# Altium schematic sheet mcu2.SchDoc
size A4
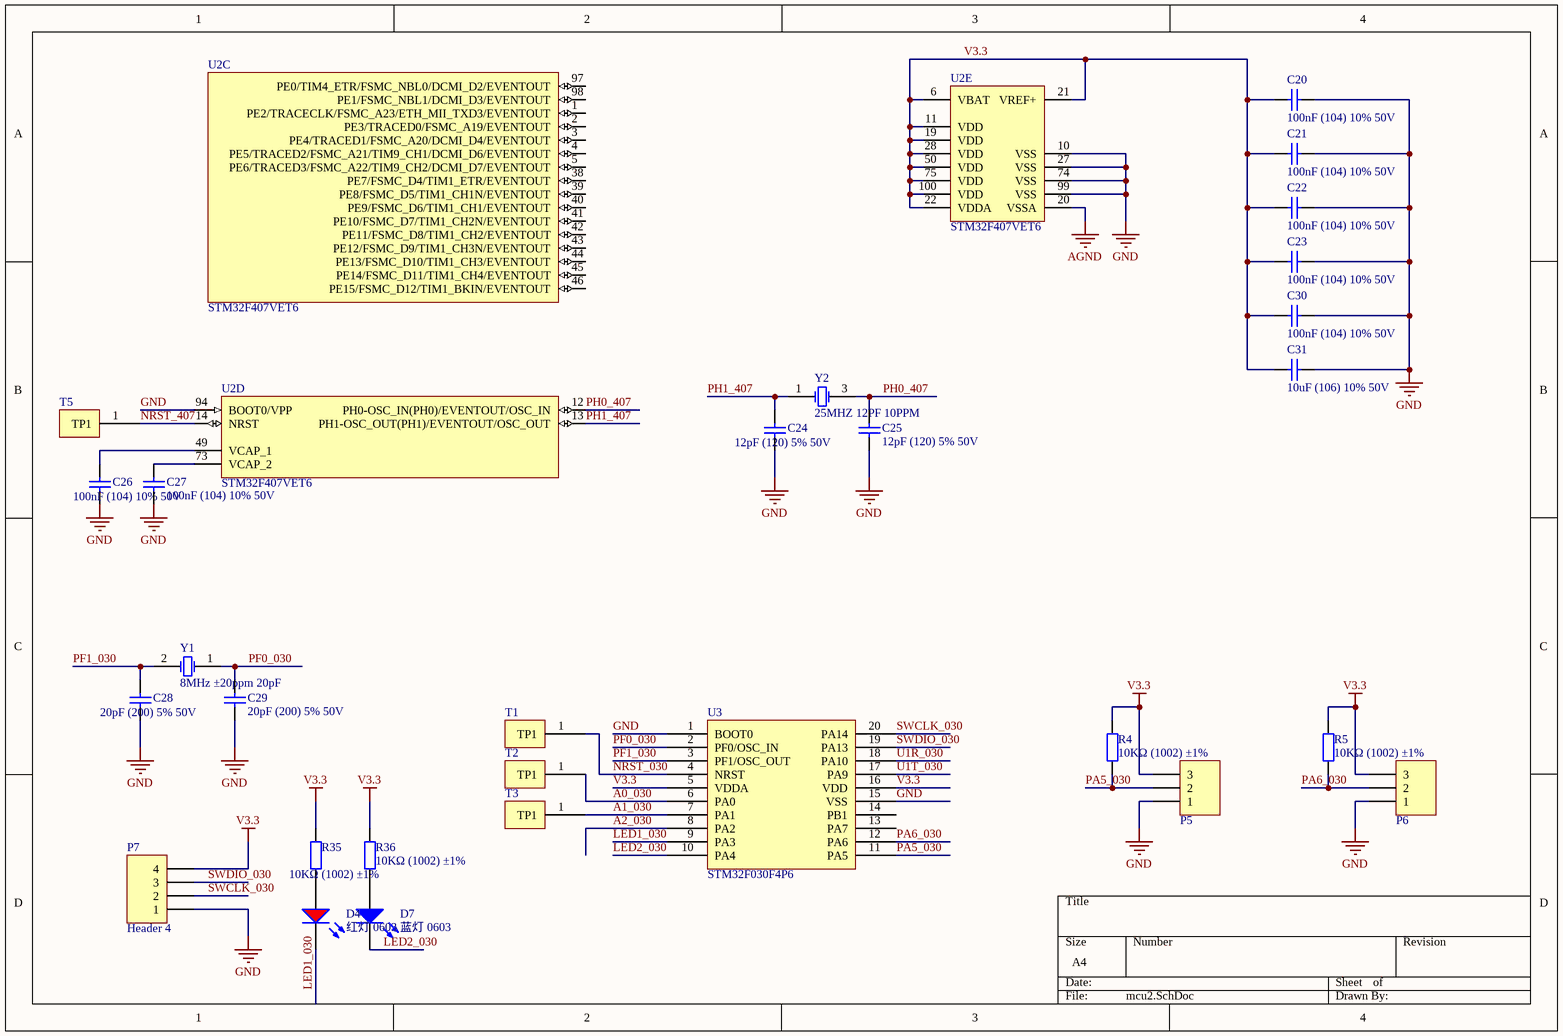
[diagram p0: mcu2.SchDoc]

## Parts
C20  100nF (104) 10% 50V  [0603_C]
C21  100nF (104) 10% 50V  [0603_C]
C22  100nF (104) 10% 50V  [0603_C]
C23  100nF (104) 10% 50V  [0603_C]
C24  12pF (120) 5% 50V  [0603_C]
C25  12pF (120) 5% 50V  [0603_C]
C26  100nF (104) 10% 50V  [0603_C]
C27  100nF (104) 10% 50V  [0603_C]
C28  20pF (200) 5% 50V  [0603_C]
C29  20pF (200) 5% 50V  [0603_C]
C30  100nF (104) 10% 50V  [1206_C]
C31  10uF (106) 10% 50V  [1206_C]
D4  红灯 0603  [0603_LED_S1]
D7  蓝灯 0603  [0603_LED_S1]
P5  Header 3  [HDR1X3]  (value not drawn)
P6  Header 3  [HDR1X3]  (value not drawn)
P7  Header 4  [HDR1X4]
R4  10KΩ (1002) ±1%  [0603_R]
R5  10KΩ (1002) ±1%  [0603_R]
R35  10KΩ (1002) ±1%  [0603_R]
R36  10KΩ (1002) ±1%  [0603_R]
T1  TP1  [TP1]  (value not drawn)
T2  TP1  [TP1]  (value not drawn)
T3  TP1  [TP1]  (value not drawn)
T5  TP1  [TP1]  (value not drawn)
U2  STM32F407VET6  [LQFP-100_14x14x05P]  (parts C,D,E of 5)
U3  STM32F030F4P6  [TSSOP-20]
Y1  8MHz ±20ppm 20pF  [SMD-5032_2P]
Y2  25MHZ 12PF 10PPM  [SMD-3225_4P]

## Nets
AGND: U2.20(VSSA)
GND: C20.2 C21.2 C22.2 C23.2 C24.1 C25.1 C26.1 C27.1 C28.1 C29.1 C30.2 C31.2 P5.1 P6.1 P7.1 U2.10(VSS) U2.27(VSS) U2.74(VSS) U2.94(BOOT0/VPP) U2.99(VSS) U3.1(BOOT0) U3.15(VSS)
V3.3: C20.1 C21.1 C22.1 C23.1 C30.1 C31.1 P5.3 P6.3 P7.4 R4.2 R5.2 R35.2 R36.2 U2.6(VBAT) U2.11(VDD) U2.19(VDD) U2.21(VREF+) U2.22(VDDA) U2.28(VDD) U2.50(VDD) U2.75(VDD) U2.100(VDD) U3.5(VDDA) U3.16(VDD)
A0_030: T2.1(TP1) U3.6(PA0)
A1_030: T3.1(TP1) U3.7(PA1)
A2_030: U3.8(PA2)
LED1_030: D4.K U3.9(PA3)
LED2_030: D7.K U3.10(PA4)
NRST_030: T1.1(TP1) U3.4(NRST)
NRST_407: T5.1(TP1) U2.14(NRST)
PA5_030: P5.2 R4.1 U3.11(PA5)
PA6_030: P6.2 R5.1 U3.12(PA6)
PF0_030: C29.2 U3.2(PF0/OSC_IN) Y1.1(OSC1)
PF1_030: C28.2 U3.3(PF1/OSC_OUT) Y1.2(OSC2)
PH0_407: C25.2 U2.12(PH0-OSC_IN(PH0)/EVENTOUT/OSC_IN) Y2.3(OSC2)
PH1_407: C24.2 U2.13(PH1-OSC_OUT(PH1)/EVENTOUT/OSC_OUT) Y2.1(OSC1)
SWCLK_030: P7.2 U3.20(PA14)
SWDIO_030: P7.3 U3.19(PA13)
U1R_030: U3.18(PA10)
U1T_030: U3.17(PA9)
NetC26_2: C26.2 U2.49(VCAP_1)
NetC27_2: C27.2 U2.73(VCAP_2)
NetD4_A: D4.A R35.1
NetD7_A: D7.A R36.1

Not connected (* = marked no-connect by the designer): U2 1(PE2/TRACECLK/FSMC_A23/ETH_MII_TXD3/EVENTOUT) 2(PE3/TRACED0/FSMC_A19/EVENTOUT) 3(PE4/TRACED1/FSMC_A20/DCMI_D4/EVENTOUT) 4(PE5/TRACED2/FSMC_A21/TIM9_CH1/DCMI_D6/EVENTOUT) 5(PE6/TRACED3/FSMC_A22/TIM9_CH2/DCMI_D7/EVENTOUT) 38(PE7/FSMC_D4/TIM1_ETR/EVENTOUT) 39(PE8/FSMC_D5/TIM1_CH1N/EVENTOUT) 40(PE9/FSMC_D6/TIM1_CH1/EVENTOUT) 41(PE10/FSMC_D7/TIM1_CH2N/EVENTOUT) 42(PE11/FSMC_D8/TIM1_CH2/EVENTOUT) 43(PE12/FSMC_D9/TIM1_CH3N/EVENTOUT) 44(PE13/FSMC_D10/TIM1_CH3/EVENTOUT) 45(PE14/FSMC_D11/TIM1_CH4/EVENTOUT) 46(PE15/FSMC_D12/TIM1_BKIN/EVENTOUT) 97(PE0/TIM4_ETR/FSMC_NBL0/DCMI_D2/EVENTOUT) 98(PE1/FSMC_NBL1/DCMI_D3/EVENTOUT); U3 13(PA7) 14(PB1)

## Library data of the parts
C20-C23 C26 C27 = 0603 100nF (104) 10% 50V: 贴片电容; ComponentLink1Description: 供应商链接; ComponentLink1URL: http://www.szlcsc.com/product/details_15331.html; Package: 0603; Supplier: LC; SuppliersPartNumber: C14663
C24 C25 = 0603 12pF (120) 5% 50V: 贴片电容; ComponentLink1Description: 供应商链接; ComponentLink1URL: http://www.szlcsc.com/product/details_39506.html; Package: 0603; Supplier: LC; SuppliersPartNumber: C38523
C28 C29 = 0603 20pF (200) 5% 50V: 贴片电容; ComponentLink1Description: 供应商链接; ComponentLink1URL: http://www.szlcsc.com/product/details_2000.html; Package: 0603; Supplier: LC; SuppliersPartNumber: C1648
C30 = 1206 100nF (104) 10% 50V: 贴片电容; ComponentLink1Description: 供应商链接; ComponentLink1URL: http://www.szlcsc.com/product/details_25237.html; Package: 1206; Supplier: LC; SuppliersPartNumber: C24497
C31 = 1206 10uF (106) 10% 50V: 贴片电容; ComponentLink1Description: 供应商链接; ComponentLink1URL: http://www.szlcsc.com/product/details_14236.html; Package: 1206; Supplier: LC; SuppliersPartNumber: C13585
D4 = 0603 红灯: 发光二极管; ComponentLink1Description: 供应商链接; ComponentLink1URL: http://www.szlcsc.com/product/details_2659.html; Package: 0603; Supplier: LC; SuppliersPartNumber: C2286
D7 = 0603 蓝灯: 发光二极管; ComponentLink1Description: 供应商链接; ComponentLink1URL: http://www.szlcsc.com/product/details_73150.html; Package: 0603; Supplier: LC; SuppliersPartNumber: C72041
P5 P6 = Header 3: Header, 3-Pin; LatestRevisionDate: 17-Jul-2002; LatestRevisionNote: Re-released for DXP Platform.; Publisher: Altium Limited
P7 = Header 4: Header, 4-Pin; LatestRevisionDate: 17-Jul-2002; LatestRevisionNote: Re-released for DXP Platform.; Publisher: Altium Limited
R4 R5 R35 R36 = 0603 10KΩ (1002) 1%: 贴片电阻; ComponentLink1Description: 供应商链接; ComponentLink1URL: http://www.szlcsc.com/product/details_26547.html; Package: 0603; Supplier: LC; SuppliersPartNumber: C25804
U2 = STM32F407VET6: ARM; ComponentLink1Description: 供应商链接; ComponentLink1URL: http://www.szlcsc.com/product/details_29482.html; Package: LQFP-100_14x14x05P; Supplier: LC; SuppliersPartNumber: C28730
U3 = STM32F030F4P6: ARM; ComponentLink1Description: 供应商链接; ComponentLink1URL: http://www.szlcsc.com/product/details_33873.html; Package: TSSOP-20; Supplier: LC; SuppliersPartNumber: C32908
Y1 = SMD-5032_2P 8MHz 20ppm 20pF: 贴片晶振; ComponentLink1Description: 供应商链接; ComponentLink1URL: http://www.szlcsc.com/product/details_117214.html; Package: SMD-5032_2P; Supplier: LC; SuppliersPartNumber: C115962
Y2 = SMD-3225_4P  25MHZ 12PF 10PPM: 贴片晶振; ComponentLink1Description: 供应商链接; ComponentLink1URL: http://www.szlcsc.com/product/details_9526.html; Package: SMD-3225_4P; Supplier: LC; SuppliersPartNumber: C9006